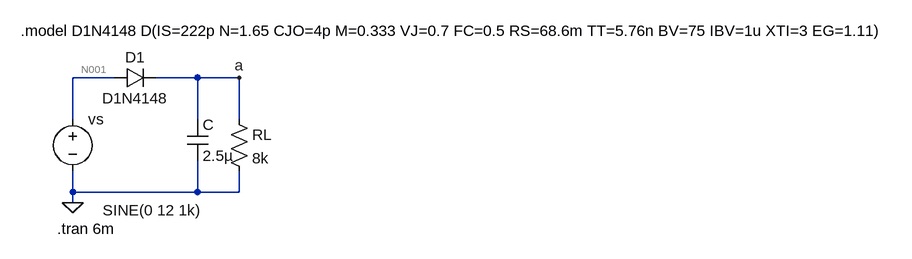
[diagram p0: schematic ej3.1.asc]
ej3.1.asc, the LTspice schematic file:
Version 4.1
SHEET 1 1304 680
WIRE 0 96 -64 96
WIRE 128 96 64 96
WIRE 192 96 128 96
WIRE -64 160 -64 96
WIRE 128 160 128 96
WIRE 192 160 192 96
WIRE -64 272 -64 240
WIRE 128 272 128 224
WIRE 128 272 -64 272
WIRE 192 272 192 240
WIRE 192 272 128 272
WIRE -64 288 -64 272
FLAG -64 288 0
FLAG 192 96 a
SYMBOL voltage -64 144 R0
WINDOW 3 46 156 Left 2
WINDOW 123 0 0 Left 0
WINDOW 39 0 0 Left 0
SYMATTR InstName vs
SYMATTR Value SINE(0 12 1k)
SYMBOL diode 0 112 R270
WINDOW 0 32 32 VTop 2
WINDOW 3 0 32 VBottom 2
SYMATTR InstName D1
SYMATTR Value D1N4148
SYMBOL res 176 144 R0
SYMATTR InstName RL
SYMATTR Value 8k
SYMBOL cap 112 160 R0
SYMATTR InstName C
SYMATTR Value 2.5µ
TEXT -144 24 Left 2 !.model D1N4148 D(IS=222p N=1.65 CJO=4p M=0.333 VJ=0.7 FC=0.5 RS=68.6m TT=5.76n BV=75 IBV=1u XTI=3 EG=1.11)
TEXT -88 328 Left 2 !.tran 6m

The netlist it stands for:
* ej3.1.asc
vs N001 0 SINE(0 12 1k)
D1 N001 a D1N4148
RL a 0 8k
C a 0 2.5µ
.model D D
.lib standard.dio
.model D1N4148 D(IS=222p N=1.65 CJO=4p M=0.333 VJ=0.7 FC=0.5 RS=68.6m TT=5.76n BV=75 IBV=1u XTI=3 EG=1.11)
.tran 6m
.backanno
.end

* Results of the author's LTspice run, read from the files saved beside the schematic
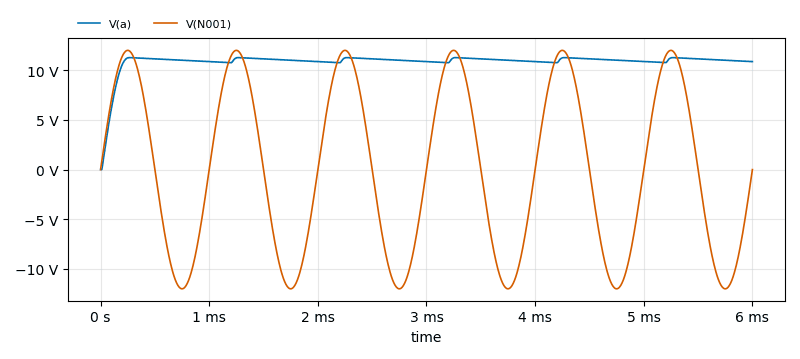
[diagram p1: Transient Analysis of ej3.1.asc, plotted from the saved traces]
* Transient Analysis, 1 run:
*   V(a): min 0 V, max 11.27 V, average 10.85 V, rms 10.91 V, last 10.87 V
*   V(N001): min -12 V, max 12 V, average 20.07 µV, rms 8.485 V, last 0 V